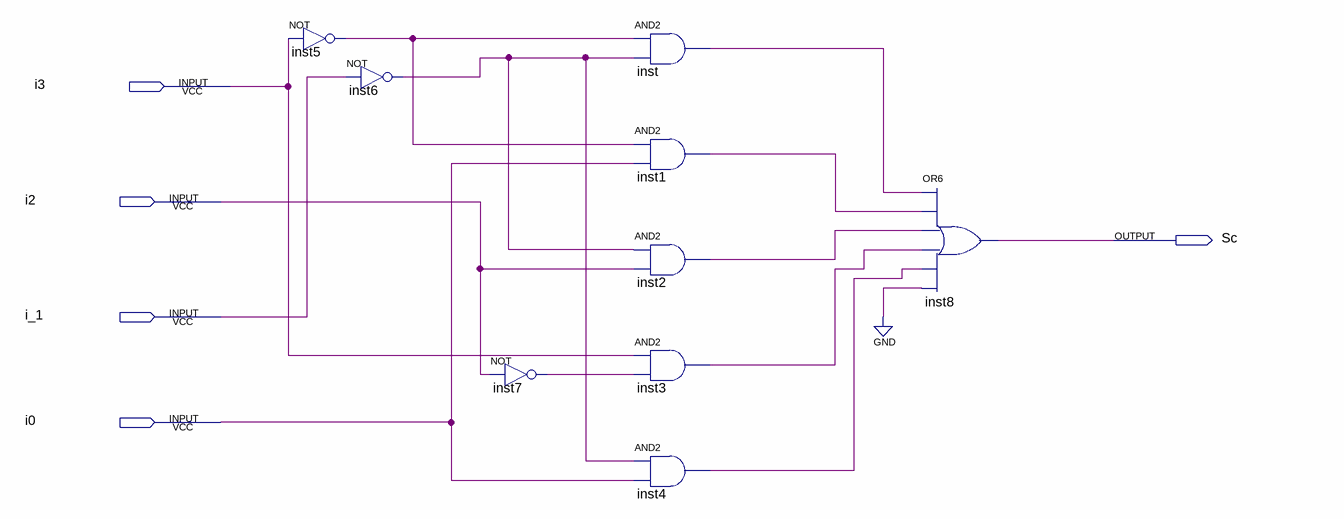
[diagram p0: schematic sheet]
// Quartus schematic lab05_c_top.bdf as structural Verilog: 9 symbols, 5 pins
module lab05_c_top (
  input  i3,
  input  i2,
  input  i_1,
  input  i0,
  output Sc
);

  wire inst1_out, inst2_out, inst3_out, inst4_out, inst5_out, inst6_out, inst7_out, inst_out;

  not inst5 (inst5_out, i3);
  not inst6 (inst6_out, i_1);
  not inst7 (inst7_out, i2);
  and inst (inst_out, inst5_out, inst6_out);
  and inst1 (inst1_out, inst5_out, i0);
  and inst2 (inst2_out, inst6_out, i2);
  and inst3 (inst3_out, i3, inst7_out);
  and inst4 (inst4_out, inst6_out, i0);
  or inst8 (Sc, inst_out, inst1_out, inst2_out, inst3_out, inst4_out, 1'b0);
endmodule
